# Altium schematic sheet LPEDT_revA1_bikeit_GPS.SchDoc: GPS
size A; Author: Dhruva Koley; DocumentNumber: 10; Revision: 1; SheetNumber: 9; SheetTotal: 11
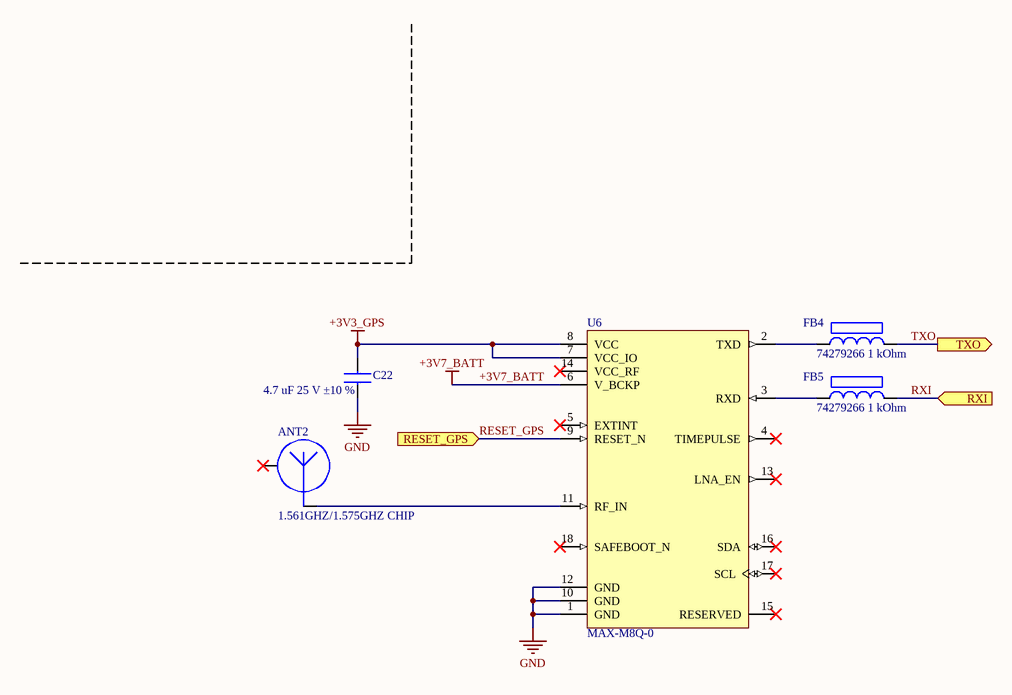
[diagram p0: LPEDT_revA1_bikeit_GPS.SchDoc]

## Parts
ANT2  1.561GHZ/1.575GHZ CHIP
C22  4.7 uF 25 V ±10 %  [CAP_0603_1.60mm*0.80mm]
FB4  74279266 1 kOhm  [FB_0603_1.60mm*0.80mm]
FB5  74279266 1 kOhm  [FB_0603_1.60mm*0.80mm]
U6  MAX-M8Q-0  [XCVR_MAX-M8C-0-10]

## Ports
RESET_GPS (in), RXI (in), TXO (out)

## Nets
+3V3_GPS: C22.1 U6.7(VCC_IO) U6.8(VCC)
+3V7_BATT: U6.6(V_BCKP)
GND: C22.2 U6.1(GND) U6.10(GND) U6.12(GND)
RESET_GPS: U6.9(RESET_N) ; port RESET_GPS
RXI: FB5.2 ; port RXI
TXO: FB4.2 ; port TXO
NetANT2_1: ANT2.1(FEED) U6.11(RF_IN)
NetFB4_1: FB4.1 U6.2(TXD)
NetFB5_1: FB5.1 U6.3(RXD)

Not connected (* = marked no-connect by the designer): ANT2 2(NC)*; U6 4(TIMEPULSE)* 5(EXTINT)* 13(LNA_EN)* 14(VCC_RF)* 15(RESERVED)* 16(SDA)* 17(SCL)* 18(SAFEBOOT_N)*

## Library data of the parts
ANT2 = 1575AT43A0040E: RF ANT 1.561GHZ/1.575GHZ CHIP; Manufacturer: Johanson; Bandwidth: 40MHz; Impedance: 50R; Power Rating: 3W; Number of Bands: 1; Return Loss: -9.5dB; Gain: -2.5dB; Supplier 1: Digi-Key; Manufacturer Part Number: 1575AT43A0040E; RoHS: Yes; Category: RF Antennas; Stock 1: 56; Pricing 1: 1=0.84000, 10=0.75200, 25=0.71400, 100=0.58650, 250=0.54824, 500=0.48450 (USD); Mount: Surface Mount; Case/Package: SMD/SMT; Number of Pins: 2; Min Operating Temperature: -40°C; Max Operating Temperature: 85°C; Packaging: Tape and Reel; Package Quantity: 1; Max Power Dissipation: 3W; Termination: Solder; Frequency: 1.575GHz; Length: 7mm; Width: 2mm; Height: 0.031inch; Lead Free: Lead Free; ComponentLink1URL: https://datasheet.ciiva.com/2792/jti-antenna-1575at43a40-2006-09-2792227.pdf?src-supplier=Digi-Key; ComponentLink1Description: https://datasheet.ciiva.com/2792/jti-antenna-1575at43a40-2006-09-2792227.pdf?src-supplier=Digi-Key; ComponentLink2URL: https://datasheet.ciiva.com/24048/antenna-1575at43a0040-258086-24048619.pdf?src-supplier=Mouser; ComponentLink2Description: https://datasheet.ciiva.com/24048/antenna-1575at43a0040-258086-24048619.pdf?src-supplier=Mouser; ComponentLink3URL: https://datasheet.ciiva.com/4172/antenna-1575at43a0040-4172807.pdf?src-supplier=Arrow+Electronics; ComponentLink3Description: https://datasheet.ciiva.com/4172/antenna-1575at43a0040-4172807.pdf?src-supplier=Arrow+Electronics; Supplier Part Number 1: 712-1003-1-ND
C22 = GRM188R61E475KE11D: Cap Ceramic 0603 4.7 uF 25 V ±10 % Tolerance X5R SMT Multilayer Ceramic Capacitor; Manufacturer: Murata; Capacitance: 4.7uF; Tolerance: 10%; Voltage Rating: 25V; Supplier 1: Digi-Key; Manufacturer Part Number: GRM188R61E475KE11D; RoHS: Yes; Category: Ceramic Capacitors; Stock 1: 307528; Pricing 1: 1=0.36000, 10=0.24700, 50=0.17280, 100=0.14820, 500=0.11112, 1000=0.09384 (USD); Mount: Surface Mount; Case/Package: 0603; Case Code (Metric): 1608; Case Code (Imperial): 0603; Material: Ceramic; Min Operating Temperature: -55°C; Max Operating Temperature: 85°C; Package Quantity: 4000; Packaging: Cut Tape; Dielectric: X5R; Voltage: 25V; Voltage Rating (DC): 25V; Series: GRM; Length: 1.6mm; Width: 0.031inch; Height: 0.8mm; Thickness: 0.031inch; Depth: 0.8mm; REACH SVHC: No SVHC; Lead Free: Lead Free; RoHS Compliant: Yes; ComponentLink1URL: https://datasheet.ciiva.com/46444/1769893-46444982.pdf?src-supplier=Element14; ComponentLink1Description: https://datasheet.ciiva.com/46444/1769893-46444982.pdf?src-supplier=Element14; ComponentLink2URL: https://datasheet.ciiva.com/46444/1769893-46444983.pdf?src-supplier=Element14; ComponentLink2Description: https://datasheet.ciiva.com/46444/1769893-46444983.pdf?src-supplier=Element14; ComponentLink3URL: https://datasheet.ciiva.com/14891/partnumbering-e-01-14891103.pdf?src-supplier=Digi-Key; ComponentLink3Description: https://datasheet.ciiva.com/14891/partnumbering-e-01-14891103.pdf?src-supplier=Digi-Key; ComponentLink4URL: https://datasheet.ciiva.com/14891/partnumbering-e-01-14891102.pdf?src-supplier=Digi-Key; ComponentLink4Description: https://datasheet.ciiva.com/14891/partnumbering-e-01-14891102.pdf?src-supplier=Digi-Key; Supplier Part Number 1: 490-7203-1-ND
FB4 FB5 = 74279266: Ferrite Bead, 0603 [1608 Metric], 1 kohm, 200 mA, WE-CBF Series, 0.6 ohm, ± 25%; Manufacturer: Wurth Electronics; Impedance: 1kR; Current Rating: 200mA; DC Resistance (DCR): 600mR; Test Frequency: 100MHz; Inductance: 1.8nH; Shielding: Unshielded; Number of Lines: 1; Supplier 1: Digi-Key; Manufacturer Part Number: 74279266; RoHS: Yes; Category: Ferrite Beads and Chips; Stock 1: 55585; Pricing 1: 1=0.17000, 50=0.16800, 100=0.15500, 500=0.14800, 1000=0.14100, 2000=0.13400 (USD); Case/Package: SMD/SMT; Case Code (Metric): 1608; Case Code (Imperial): 0603; Core Material: Ferrite; Min Operating Temperature: -55°C; Max Operating Temperature: 125°C; Tolerance: 25%; Packaging: Tape and Reel; Series: WE-CBF; Max DC Current: 200mA; Termination: SMD/SMT; Max Current Rating: 200mA; Length: 1.6mm; Width: 0.8mm; Height: 0.8mm; Depth: 0.8mm; REACH SVHC: Unknown; Lead Free: Lead Free; RoHS Compliant: Yes; ComponentLink1URL: https://datasheet.ciiva.com/14634/0900766b801ef1d0-14634816.pdf?src-supplier=Allied+Electronics; ComponentLink1Description: https://datasheet.ciiva.com/14634/0900766b801ef1d0-14634816.pdf?src-supplier=Allied+Electronics; ComponentLink2URL: https://datasheet.ciiva.com/23763/74279266-23763009.pdf?src-supplier=Newark; ComponentLink2Description: https://datasheet.ciiva.com/23763/74279266-23763009.pdf?src-supplier=Newark; ComponentLink3URL: https://datasheet.ciiva.com/11799/0900766b801ef1d0-11799352.pdf?src-supplier=RSComponents; ComponentLink3Description: https://datasheet.ciiva.com/11799/0900766b801ef1d0-11799352.pdf?src-supplier=RSComponents; ComponentLink4URL: https://datasheet.ciiva.com/14971/74279266-14971192.pdf?src-supplier=Digi-Key; ComponentLink4Description: https://datasheet.ciiva.com/14971/74279266-14971192.pdf?src-supplier=Digi-Key; ComponentLink5URL: https://datasheet.ciiva.com/12395/74279266-221135-12395453.pdf?src-supplier=Mouser; ComponentLink5Description: https://datasheet.ciiva.com/12395/74279266-221135-12395453.pdf?src-supplier=Mouser; ComponentLink6URL: https://datasheet.ciiva.com/1466/1705901-1466509.pdf?src-supplier=Element14; ComponentLink6Description: https://datasheet.ciiva.com/1466/1705901-1466509.pdf?src-supplier=Element14; ComponentLink7URL: https://datasheet.ciiva.com/22711/1705901-22711422.pdf?src-supplier=Element14; ComponentLink7Description: https://datasheet.ciiva.com/22711/1705901-22711422.pdf?src-supplier=Element14; ComponentLink8URL: https://datasheet.ciiva.com/48698/001087059-da-01-ml-we-cbf-smd-ferrit-74279266-de-en-48698427.pdf?src-supplier=Conrad; ComponentLink8Description: https://datasheet.ciiva.com/48698/001087059-da-01-ml-we-cbf-smd-ferrit-74279266-de-en-48698427.pdf?src-supplier=Conrad; Supplier Part Number 1: 732-4484-1-ND
U6 = MAX-M8Q-0: MAX-M8 RF Receiver BeiDou, Galileo, GLONASS, GNSS, GPS 1.575GHz -167dBm; MF: U-Blox America; MP: MAX-M8Q-0; Availability: Warning; Check_prices: https://www.snapeda.com/parts/MAX-M8Q-0/U-Blox%20America%20Inc./view-part/563405/?ref=eda; Price: None; SnapEDA_Link: https://www.snapeda.com/parts/MAX-M8Q-0/U-Blox%20America%20Inc./view-part/563405/?ref=snap; Purchase-URL: https://pricing.snapeda.com/search/part/MAX-M8Q-0/?ref=eda; Package: SMD-18 u-blox; Value: *; Supplier 1: Digi-Key; Supplier Part Number 1: 672-MAX-M8Q-0TR-ND